# Altium schematic sheet Integrators.SchDoc
size Tabloid; SheetNumber: 5; SheetTotal: 6
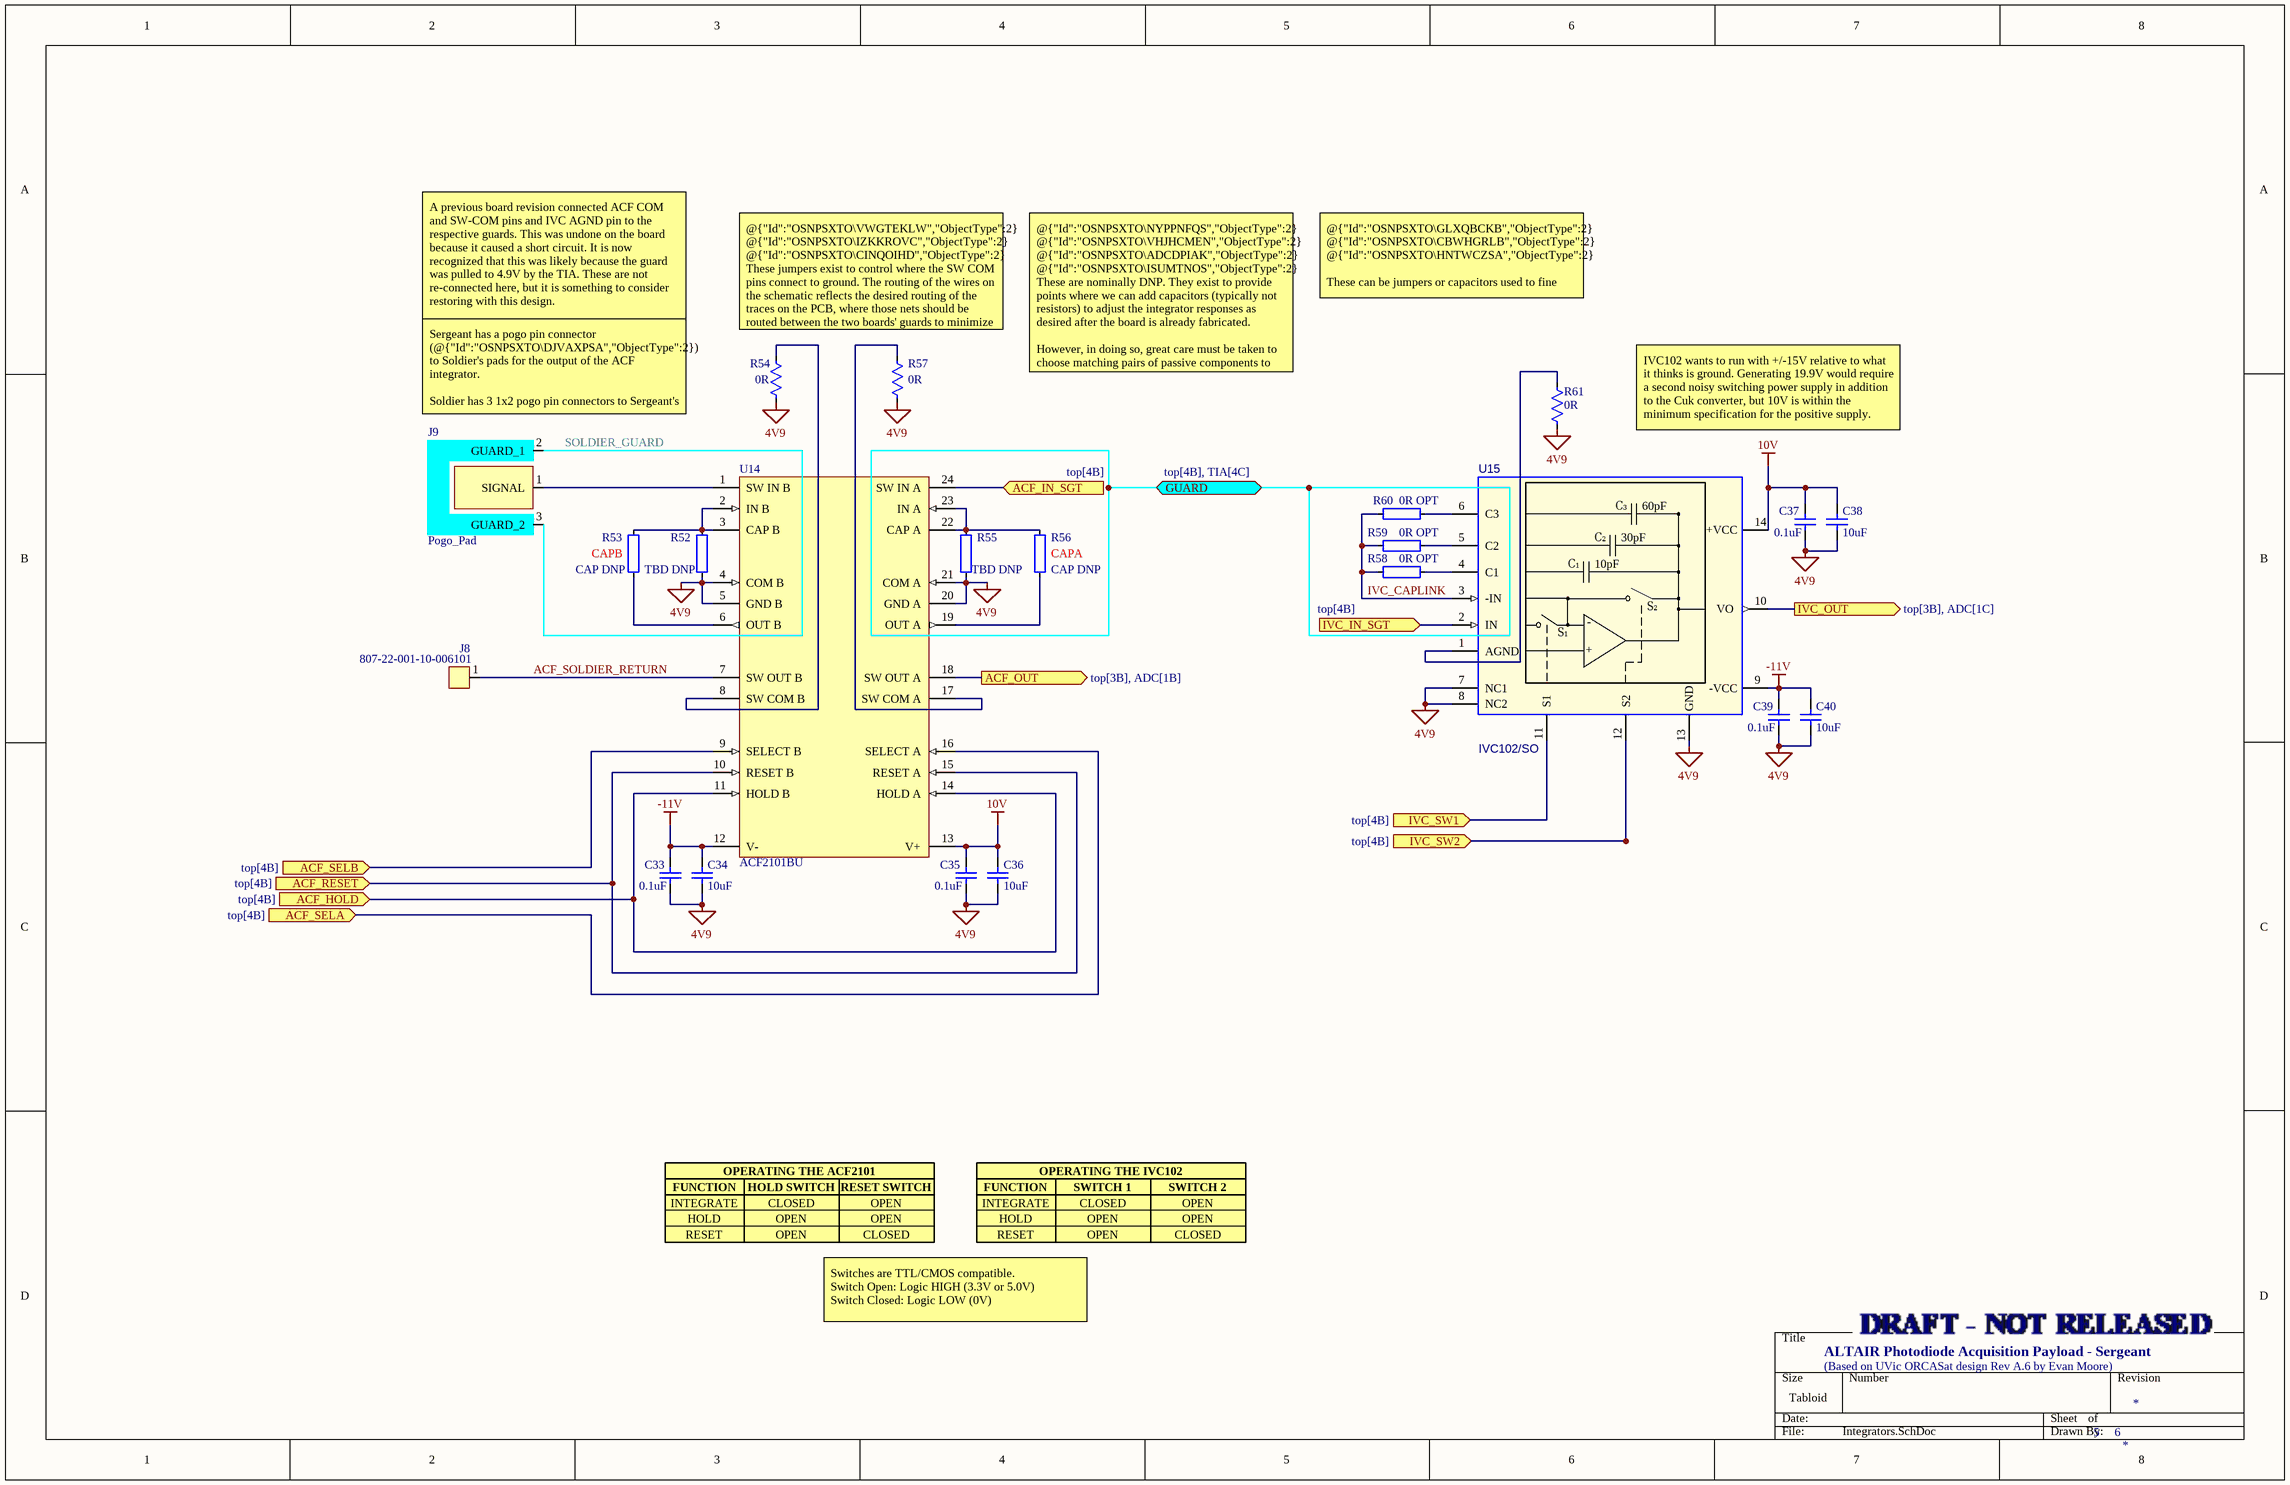
[diagram p0: Integrators.SchDoc]

## Parts
C33  0.1uF  [CAP 0603 NON-IPC KEMET X7R]
C34  10uF  [CAP 0805 IPC MID DENSITY]
C35  0.1uF  [CAP 0603 NON-IPC KEMET X7R]
C36  10uF  [CAP 0805 IPC MID DENSITY]
C37  0.1uF  [CAP 0603 NON-IPC KEMET X7R]
C38  10uF  [CAP 0805 IPC MID DENSITY]
C39  0.1uF  [CAP 0603 NON-IPC KEMET X7R]
C40  10uF  [CAP 0805 IPC MID DENSITY]
J8  807-22-001-10-006101  [POGO PIN 807-22-001-10-006101]
J9  Pogo_Pad  [POGO PAD SERGEANT]  (no BOM)
R52  TBD DNP  [RES 0402 IPC LOW DENSITY]
R53  CAP DNP  [RES 0402 IPC LOW DENSITY]
R54  0R  [RES 0402 IPC MID DENSITY]
R55  TBD DNP  [RES 0402 IPC LOW DENSITY]
R56  CAP DNP  [RES 0402 IPC LOW DENSITY]
R57  0R  [RES 0402 IPC MID DENSITY]
R58  0R OPT  [RES 0402 IPC LOW DENSITY]
R59  0R OPT  [RES 0402 IPC LOW DENSITY]
R60  0R OPT  [RES 0402 IPC LOW DENSITY]
R61  0R  [RES 0402 IPC MID DENSITY]
U14  ACF2101BU  [24-SOIC 7.6MM WIDE LOW DENSITY]
U15  IVC102/SO  [14-SOIC 4MM WIDE LOW DENSITY]

## Ports
ACF_HOLD (in, see top[4B]), ACF_IN_SGT (in, see top[4B]), ACF_OUT (out, see top[3B], ADC[1B]), ACF_RESET (in, see top[4B]), ACF_SELA (in, see top[4B]), ACF_SELB (in, see top[4B]), GUARD (bidir, see top[4B], TIA[4C]), IVC_IN_SGT (in, see top[4B]), IVC_OUT (out, see top[3B], ADC[1C]), IVC_SW1 (in, see top[4B]), IVC_SW2 (in, see top[4B])

## Nets
4V9: C33.1 C34.1 C35.1 C36.1 C37.1 C38.1 C39.1 C40.1 R52.1 R54.2 R55.1 R57.2 R61.2 U14.4(COM_B) U14.5(GND_B) U14.20(GND_A) U14.21(COM_A) U15.7(NC1) U15.8(NC2) U15.13(GND)
10V: C35.2 C36.2 C37.2 C38.2 U14.13(V+) U15.14(+VCC)
-11V: C33.2 C34.2 C39.2 C40.2 U14.12(V-) U15.9(-VCC)
ACF_HOLD: U14.11(HOLD_B) U14.14(HOLD_A) ; port ACF_HOLD
ACF_IN_SGT: U14.24(SW_IN_A) ; port ACF_IN_SGT
ACF_OUT: U14.18(SW_OUT_A) ; port ACF_OUT
ACF_RESET: U14.10(RESET_B) U14.15(RESET_A) ; port ACF_RESET
ACF_SELA: U14.16(SELECT_A) ; port ACF_SELA
ACF_SELB: U14.9(SELECT_B) ; port ACF_SELB
ACF_SOLDIER_RETURN: J8.1 U14.7(SW_OUT_B)
IVC_CAPLINK: R58.1 R59.1 R60.1 U15.3(-IN)
IVC_IN_SGT: U15.2(IN) ; port IVC_IN_SGT
IVC_OUT: U15.10(VO) ; port IVC_OUT
IVC_SW1: U15.11(S1) ; port IVC_SW1
IVC_SW2: U15.12(S2) ; port IVC_SW2
SOLDIER_GUARD: J9.2(GUARD_1) J9.3(GUARD_2)
NetJ9_1: J9.1(SIGNAL) U14.1(SW_IN_B)
NetR52_2: R52.2 R53.2 U14.2(IN_B) U14.3(CAP_B)
NetR53_1: R53.1 U14.6(OUT_B)
NetR54_1: R54.1 U14.8(SW_COM_B)
NetR55_2: R55.2 R56.2 U14.22(CAP_A) U14.23(IN_A)
NetR56_1: R56.1 U14.19(OUT_A)
NetR57_1: R57.1 U14.17(SW_COM_A)
NetR58_2: R58.2 U15.4(C1)
NetR59_2: R59.2 U15.5(C2)
NetR60_2: R60.2 U15.6(C3)
NetR61_1: R61.1 U15.1(AGND)

## Notes on the sheet
- @{"Id":"OSNPSXTO\GLXQBCKB","ObjectType":2} @{"Id":"OSNPSXTO\CBWHGRLB","ObjectType":2} @{"Id":"OSNPSXTO\HNTWCZSA","ObjectType":2}
  These can be jumpers or capacitors used to fine tune the IVC's response. At least one must be populated to close the op-amp feedback loop.
- A previous board revision connected ACF COM and SW-COM pins and IVC AGND pin to the respective guards. This was undone on the board because it caused a short circuit. It is now recognized that this was likely because the guard was pulled to 4.9V by the TIA. These are not re-connected here, but it is something to consider restoring with this design.
- @{"Id":"OSNPSXTO\VWGTEKLW","ObjectType":2} @{"Id":"OSNPSXTO\IZKKROVC","ObjectType":2} @{"Id":"OSNPSXTO\CINQOIHD","ObjectType":2}
  These jumpers exist to control where the SW COM pins connect to ground. The routing of the wires on the schematic reflects the desired routing of the traces on the PCB, where those nets should be routed between the two boards' guards to minimize crosstalk between them.
- @{"Id":"OSNPSXTO\NYPPNFQS","ObjectType":2} @{"Id":"OSNPSXTO\VHJHCMEN","ObjectType":2} @{"Id":"OSNPSXTO\ADCDPIAK","ObjectType":2} @{"Id":"OSNPSXTO\ISUMTNOS","ObjectType":2}
  These are nominally DNP. They exist to provide points where we can add capacitors (typically not resistors) to adjust the integrator responses as desired after the board is already fabricated.
  However, in doing so, great care must be taken to choose matching pairs of passive components to keep the two sides of the integrator as close as possible in response.
- (near J9) Sergeant has a pogo pin connector (@{"Id":"OSNPSXTO\DJVAXPSA","ObjectType":2}) to Soldier's pads for the output of the ACF integrator.
  Soldier has 3 1x2 pogo pin connectors to Sergeant's pads (@{"Id":"OSNPSXTO\OGXMUVET","ObjectType":2}) for the input and guard on its side of the ACF integrator.
- IVC102 wants to run with +/-15V relative to what it thinks is ground. Generating 19.9V would require a second noisy switching power supply in addition to the Cuk converter, but 10V is within the minimum specification for the positive supply.
- (near R53) CAPB
- (near R56) CAPA
- FUNCTION
- INTEGRATE
- HOLD
- RESET
- OPERATING THE ACF2101
- HOLD SWITCH
- CLOSED
- OPEN
- RESET SWITCH
- OPERATING THE IVC102
- SWITCH 1
- SWITCH 2
- Switches are TTL/CMOS compatible.
  Switch Open: Logic HIGH (3.3V or 5.0V)
  Switch Closed: Logic LOW (0V)
- ALTAIR Photodiode Acquisition Payload - Sergeant
- (Based on UVic ORCASat design Rev A.6 by Evan Moore)
- (in symbol IVC102/SO_5) C₃; 60pF; C₂; 30pF; C₁; 10pF; S₂; -; S₁; +

## Library data of the parts
C33 C35 C37 C39 = CAP: Kemet C0603C104K5RACAUTO - Cap Ceramic 0.1uF 50V X7R 10% 0603 125C Paper T/R; MF: Kemet; MP: C0603C104K5RACAUTO
C34 C36 C38 C40 = CAP: Murata GRM21BR61E106KA73L - Cap Ceramic 10uF 10% 25V X5R 0805; MF: Murata; MP: GRM21BR61E106KA73L
J8 = 807-22-001-10-006101: Mill-Max Individual Insulated Pin 5.99mm Initial Height; MF: Mill-Max; MP: 807-22-001-10-006101
J9 = Pogo_Pad: Pad for Pogo Pins with Guard; pin to pad: 3>2; System: Connector
R52 R53 R55 R56 R58-R60 = IMPEDANCE: Yageo RC0402JR-070RL - Res 0 Ohms 1/16W SMD 0402; MF: YAGEO; MP: RC0402JR-070RL
R54 R57 R61 = RES: Yageo RC0402JR-070RL - Res 0 Ohms 1/16W SMD 0402; MF: YAGEO; MP: RC0402JR-070RL
U14 = ACF2101BU: Low Noise, Dual Switched Integrator, 14.5 to 36 V, -40 to 125 degC, 24-pin SOIC (DW24), Green (RoHS & no Sb/Br); Iq per channel(Max)(mA): 15; Vio (25C)(Max)(mV): 2; Total Supply Voltage(Max)(+5V is 5, +/-5V is 10): 36; Slew Rate(Typ)(V/us): 3; Rating: Catalog; Packing: TUBE; Sub Family: Precision Amplifier; MF: Texas Instruments; Offset Drift(Typ)(uV/C): 1; Total Supply Voltage(Min)(+5V is 5, +/-5V is 10): 14.5; Code_JEDEC: MS-013; PackageReference: DW0024A; ComponentLink2Description: Datasheet; Eco-Plan: Green (RoHS & no Sb/Br); ComponentLink3Description: Package Specification; ComponentLink2URL: http://www.ti.com/lit/ds/symlink/acf2101.pdf; DatasheetVersion: SBFS003; ComponentLink1URL: http://www.ti.com/; ComponentLink1Description: Manufacturer URL; ComponentLink3URL: http://www.ti.com/litv/pdf/mpds174a; MP: ACF2101BU; PackageVersion: 4040000-5/G, 01/2011; Number of Channels: 2; PackageDescription: 24-Pin Plastic Small Outline, Body 15.4 x 7.5 mm, Pitch 1.27 mm; GBW(Typ)(MHz): 2; Mounting Technology: Surface Mount
U15 = IVC102/SO_5: Precision Switched Integrator Transimpedance Amplifier; Part Reference: U1; MF: Texas Instruments; MP: IVC102U; Value: IVC102/SO